# Altium schematic sheet Flexi_encoder_BOB.SchDoc: RP2040 CNC
size B; Author: AM; CompanyName: Expatria Technologies; DrawnBy: A.Marles; Engineer: AM; Organization: Expatria Technolgoies; Address1: Schematic; DocumentNumber: 2; SheetNumber: 2; SheetTotal: 5
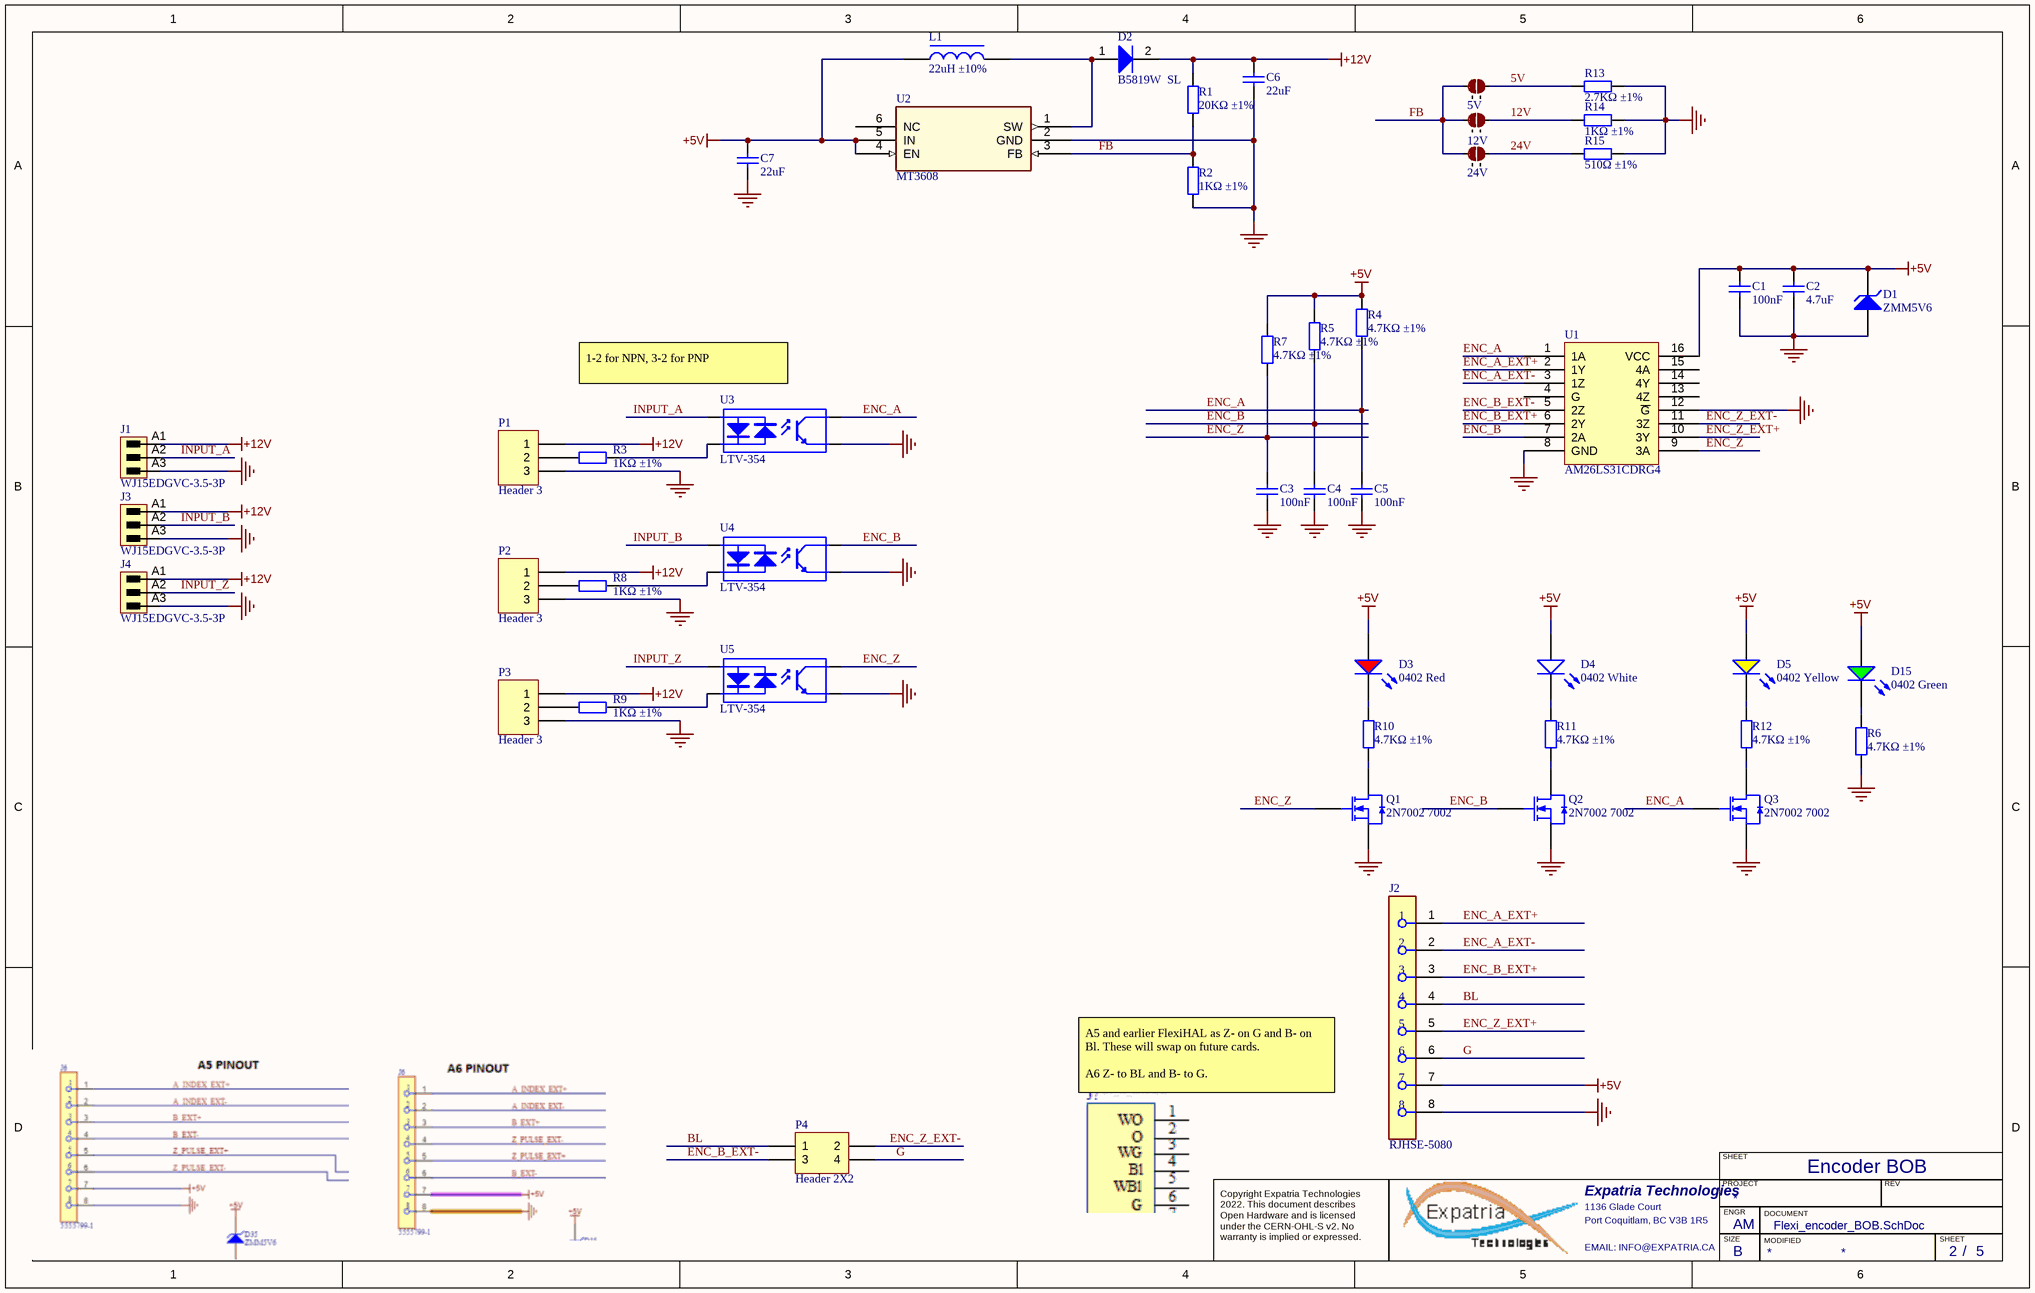
[diagram p0: Flexi_encoder_BOB.SchDoc]

## Parts
5V  2 way net solder junction - Normally Open  [2waySolder_NO]  (value not drawn)  (no BOM)
12V  2 way net solder junction - Normally Open  [2waySolder_NO]  (value not drawn)  (no BOM)
24V  2 way net solder junction - Normally Open  [2waySolder_NO]  (value not drawn)  (no BOM)
C1  100nF  [0402_C]
C2  4.7uF  [0402_C]
C3  100nF  [0402_C]
C4  100nF  [0402_C]
C5  100nF  [0402_C]
C6  22uF  [0805_C]
C7  22uF  [0805_C]
D1  ZMM5V6  [LL-34]
D2  B5819W  SL  [SOD-123]
D3  0402 Red  [LED 0402_1005 RED]
D4  0402 White  [LED 0402_1005 RED]
D5  0402 Yellow  [LED 0402_1005 RED]
D15  0402 Green  [LED 0402_1005 RED]
J1  WJ15EDGVC-3.5-3P  [691321100003 - 3.5mm  3p]
J2  RJHSE-5080  [FP-RJHSE-5080-MFG]
J3  WJ15EDGVC-3.5-3P  [691321100003 - 3.5mm  3p]
J4  WJ15EDGVC-3.5-3P  [691321100003 - 3.5mm  3p]
L1  22uH ±10%  [INDP4040X30N]
P1  Header 3  [HDR1X3]
P2  Header 3  [HDR1X3]
P3  Header 3  [HDR1X3]
P4  Header 2X2  [HDR2X2]
Q1  2N7002 7002  [SOT-23(SOT-23-3)]
Q2  2N7002 7002  [SOT-23(SOT-23-3)]
Q3  2N7002 7002  [SOT-23(SOT-23-3)]
R1  20KΩ ±1%  [0402_R]
R2  1KΩ ±1%  [0402_R]
R3  1KΩ ±1%  [0402_R]
R4  4.7KΩ ±1%  [0402_R]
R5  4.7KΩ ±1%  [0402_R]
R6  4.7KΩ ±1%  [0402_R]
R7  4.7KΩ ±1%  [0402_R]
R8  1KΩ ±1%  [0402_R]
R9  1KΩ ±1%  [0402_R]
R10  4.7KΩ ±1%  [0402_R]
R11  4.7KΩ ±1%  [0402_R]
R12  4.7KΩ ±1%  [0402_R]
R13  2.7KΩ ±1%  [0603_R]
R14  1KΩ ±1%  [0402_R]
R15  510Ω ±1%  [0402_R]
U1  AM26LS31CDRG4  [SOIC-16_150mil]
U2  MT3608  [TSOT23-6SOT23-6_AER]
U3  LTV-354  [SOP-4_P2.54]
U4  LTV-354  [SOP-4_P2.54]
U5  LTV-354  [SOP-4_P2.54]

## Nets
+5V: C1.1 C2.1 C7.2 D1.2(K) D3.A D4.A D5.A D15.A J2.7 L1.1 R4.2 R5.2 R7.2 U1.16(VCC) U2.4(EN) U2.5(IN)
+12V: C6.2 D2.2(K) J1.A1 J3.A1 J4.A1 P1.1 P2.1 P3.1 R1.2
GND: C1.2 C2.2 C3.2 C4.2 C5.2 C6.1 C7.1 D1.1(A) J1.A3 J2.8 J3.A3 J4.A3 P1.3 P2.3 P3.3 Q1.2(S) Q2.2(S) Q3.2(S) R2.1 R6.1 R13.2 R14.1 R15.2 U1.8(GND) U1.12(~{G}) U2.2(GND) U3.3(E) U4.3(E) U5.3(E)
5V: 5V.2 R13.1
12V: 12V.2 R14.2
24V: 24V.2 R15.1
BL: J2.4 P4.1
ENC_A: C5.1 Q3.1(G) R4.1 U1.1(1A) U3.4(C)
ENC_A_EXT+: J2.1 U1.2(1Y)
ENC_A_EXT-: J2.2 U1.3(1Z)
ENC_B: C4.1 Q2.1(G) R5.1 U1.7(2A) U4.4(C)
ENC_B_EXT+: J2.3 U1.6(2Y)
ENC_B_EXT-: P4.3 U1.5(2Z)
ENC_Z: C3.1 Q1.1(G) R7.1 U1.9(3A) U5.4(C)
ENC_Z_EXT+: J2.5 U1.10(3Y)
ENC_Z_EXT-: P4.2 U1.11(3Z)
FB: 5V.1 12V.1 24V.1 R1.1 R2.2 U2.3(FB)
G: J2.6 P4.4
INPUT_A: J1.A2 U3.1(A)
INPUT_B: J3.A2 U4.1(A)
INPUT_Z: J4.A2 U5.1(A)
NetD2_1: D2.1(A) L1.2 U2.1(SW)
NetD3_K: D3.K R10.2
NetD4_K: D4.K R11.2
NetD5_K: D5.K R12.2
NetD15_K: D15.K R6.2
NetP1_2: P1.2 R3.2
NetP2_2: P2.2 R8.2
NetP3_2: P3.2 R9.2
NetQ1_3: Q1.3(D) R10.1
NetQ2_3: Q2.3(D) R11.1
NetQ3_3: Q3.3(D) R12.1
NetR3_1: R3.1 U3.2(K)
NetR8_1: R8.1 U4.2(K)
NetR9_1: R9.1 U5.2(K)

Not connected (* = marked no-connect by the designer): U1 4(G) 13(4Z) 14(4Y) 15(4A); U2 6(NC)

## Notes on the sheet
- (near U3) 1-2 for NPN, 3-2 for PNP
- A5 and earlier FlexiHAL as Z- on G and B- on Bl. These will swap on future cards.
  A6 Z- to BL and B- to G.
- Encoder BOB
- SHEET
- Expatria Technologies
- 1136 Glade Court
- Port Coquitlam, BC V3B 1R5
- PROJECT
- SIZE
- ENGR
- MODIFIED
- DOCUMENT
- REV
- Copyright Expatria Technologies 2022. This document describes Open Hardware and is licensed under the CERN-OHL-S v2. No warranty is implied or expressed.
- EMAIL: INFO@EXPATRIA.CA
- B
- /

## Library data of the parts
5V 12V 24V = 2waySolderNO: ComponentLink1URL: http://www.edatools.cz/addons; ComponentLink1Description: Source
C1 C3-C5 = 0402 100nF (104) 10% 16V: Chip capacitors; Manufacturer: Samsung Electro-Mechanics; PartNumber: CL05B104KO5NNNC; Tolerance: 10%; Voltage: 16V; ComponentLink1Description: Supplier link; ComponentLink1URL: http://www.szlcsc.com/product/details_1877.html; Package: 0402; Supplier: LC; SuppliersPartNumber: C1525; Capacitance: 100nF
C2 = 0402 4.7uF (475) 20% 10V: Chip capacitor; Manufacturer: Samsung Electro-Mechanics; PartNumber: CL05A475MP5NRNC; Tolerance: 20%; Voltage: 10V; ComponentLink1Description: Supplier link; ComponentLink1URL: http://www.szlcsc.com/product/details_24469.html; Package: 0402; Supplier: LC; SuppliersPartNumber: C23733; Capacitance: 4.7uF
C6 C7 = 0805 22uF (226) 20% 25V: Chip capacitors; Manufacturer: Samsung Electro-Mechanics; PartNumber: CL21A226MAQNNNE; Tolerance: 20%; Voltage: 25V; ComponentLink1Description: Supplier link; ComponentLink1URL: http://www.szlcsc.com/product/details_46786.html; Package: 0805; Supplier: LC; SuppliersPartNumber: C5674; Capacitance: 22uF
D1 = LL-34 ZMM5V6: 500mW - 0.1uA @ 1V 5.6V LL-34 Zener Diodes ROHS; ComponentLink1Description: 供应商链接; ComponentLink1URL: http://www.szlcsc.com/product/details_8541.html; Package: LL-34; Supplier: LC; SuppliersPartNumber: C8062
D2 = SOD-123 B5819W  SL: Schottky Diode; ComponentLink1Description: 供应商链接; ComponentLink1URL: http://www.szlcsc.com/product/details_9093.html; Package: SOD-123; Supplier: LC; SuppliersPartNumber: C8598
D3 = 0402 LED Red: LED; Package: 0402; Supplier: LC; SuppliersPartNumber: C130720; Color: Red
D4 = 0402 LED White: LED; Package: 0402; Supplier: LC; SuppliersPartNumber: C130725; Color: White
D5 = 0402 LED Yellow: LED; Package: 0402; Supplier: LC; SuppliersPartNumber: C130721; Color: Yellow; ComponentLink1Description: 供应商链接; ComponentLink1URL: http://www.szlcsc.com/product/details_73147.html
D15 = 0402 LED Green: LED; Package: 0402; Supplier: LC; SuppliersPartNumber: C130723; Color: Green
J1 J3 J4 = 3.5mm Terminal Header 3p: Header,Male Pin,Covered(4 Sided) 3 1 0.138"（3.50mm） 3 P=3.5mm Pluggable System Terminal Block RoHS; Manufacturer: Ningbo Kangnex Elec; Pitch_mm: 3.5 mm; UL_94_flammability_rating: V-0; Side_termination_characteristic: closed side; Solder_pin_length_mm: 3.2 mm; Short_text_for_material: SL 3.50/03/180G 3.2SN OR BX; Pitch_inch: 0.138 inch; PartNumber: WJ15EDGVC-3.5-3P; PackageReference: SL_3_50_180G_03; ComponentLink1URL: http://www.weidmueller.com/; ComponentLink1Description: Manufacturer URL; Packaging: Box; Revision: V1; SuppliersPartNumber: C192778; Manufacturer 1: Ningbo Kangnex Elec; Manufacturer Part Number 1: WJ15EDGVC-3.5-3P; Package: P=3.5mm
J2 = CMP-02366-000003-1: CONN MOD JACK 8P8C R/A UNSHLD; Manufacturer Part Number: E5J88-00LJG2-L; Manufacturer: Pulse Electronics Network; Pitch: 1.02mm; ComponentLink2URL: https://cdn.amphenol-icc.com/media/wysiwyg/files/documentation/datasheet/inputoutput/io-modjack-rjhse.pdf; Device Class L1: Connectors; Package: CONN_MOD_JACK; Digikey Description: CONN MOD JACK 8P8C R/A UNSHLD; ComponentLink2Description: Datasheet; SuppliersPartNumber: C385834
L1 = 4x4x3 22uH 20%: 1A 22uH ±20% SMD,4x4x3mm Power Inductors ROHS; Package: SMD,4x4x3mm; Supplier: LC; SuppliersPartNumber: C167883
P1-P3 = Header 3: Header, 3-Pin; Publisher: Altium Limited; SuppliersPartNumber: C49257
P4 = Header 2X2: Header, 2-Pin, Dual row; Supplier: LC; SuppliersPartNumber: C66690
Q1-Q3 = 2N7002 7002: MOS(场效应管); ComponentLink1Description: 供应商链接; ComponentLink1URL: http://www.szlcsc.com/product/details_9040.html; Package: SOT-23(SOT-23-3); Supplier: LC; SuppliersPartNumber: C8545
R1 = 0402 20K (2002) 1%: Chip resistor; Manufacturer: Uniroyal Elec; PartNumber: 0402WGF2002TCE; Power: 1/16W; ComponentLink1Description: Supplier link; ComponentLink1URL: http://www.szlcsc.com/product/details_26508.html; Package: 0402; Supplier: LC; SuppliersPartNumber: C25765; Resistance: 20KΩ; Tolerance: 1%
R2 R3 R8 R9 R14 = 0402 1K (1001) 1%: Chip resistor; Manufacturer: Uniroyal Elec; PartNumber: 0402WGF1001TCE; Power: 1/16W; ComponentLink1Description: Supplier link; ComponentLink1URL: http://www.szlcsc.com/product/details_12256.html; Package: 0402; Supplier: LC; SuppliersPartNumber: C11702; Resistance: 1KΩ; Tolerance: 1%
R4-R7 R10-R12 = 0402 4.7K (4701) 1%: Chip resistor; Manufacturer: Uniroyal Elec; PartNumber: 0402WGF4701TCE; Power: 1/16W; ComponentLink1Description: Supplier link; ComponentLink1URL: http://www.szlcsc.com/product/details_26643.html; Package: 0402; Supplier: LC; SuppliersPartNumber: C25900; Resistance: 4.7KΩ; Tolerance: 1%
R13 = 0603 2.7K (2701) 1%: Chip resistor; Manufacturer: Uniroyal Elec; PartNumber: 0603WAF2701T5E; Power: 1/10W; ComponentLink1Description: Supplier link; ComponentLink1URL: http://www.szlcsc.com/product/details_13814.html; Package: 0603; Supplier: LC; SuppliersPartNumber: C13167; Resistance: 2.7KΩ; Tolerance: 1%
R15 = 0402 510R (5100) 1%: Chip resistor; Manufacturer: Uniroyal Elec; PartNumber: 0402WGF5100TCE; Power: 1/16W; ComponentLink1Description: Supplier link; ComponentLink1URL: http://www.szlcsc.com/product/details_25866.html; Package: 0402; Supplier: LC; SuppliersPartNumber: C25123; Resistance: 510Ω; Tolerance: 1%
U1 = AM26LS31CDRG4_[C6179]: 4/0 Driver - RS422, RS485 16-SOIC; Manufacturer 1: Texas Instruments; ComponentLink1Description: 供应商链接; ComponentLink1URL: http://www.szlcsc.com/product/details_6645.html; Package: SOIC-16_150mil; Supplier: LC; SuppliersPartNumber: C6179; Manufacturer Part Number 1: AM26LS31CDR
U2 = MT3608: No Description Available; Mfr_Name: Aerosemi; RefDes: RefDes; Type: Type; SuppliersPartNumber: *
U3-U5 = LTV-354: 35V 3.75kV 50mA 100mV@1mA,20mA 1 1.2V AC,DC SOP-4-2.54mm Transistor, Photovoltaic Output Optoisolators ROHS; Package: SOP-4_P2.54; Supplier: LC; SuppliersPartNumber: C10802